# Altium project eRTM15_Baikal.PrjPCB (part 4 of 4)
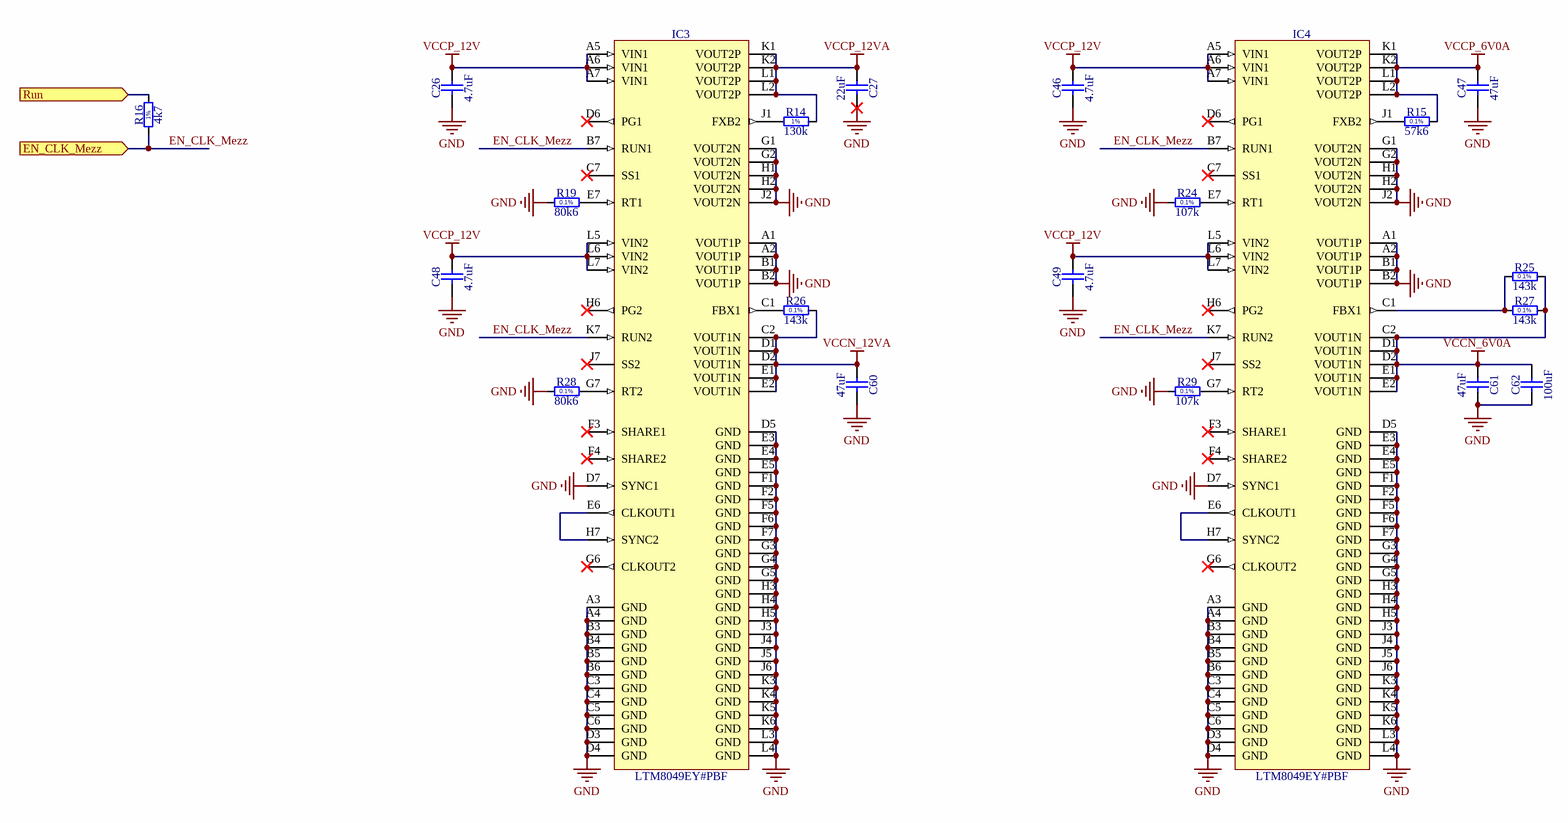
[diagram p111: PowerSupply4ClkMezzanine.SchDoc]

## Nets that join several sheets
GND: FP_connectors (30 pins), PowerSupply (79 pins), BackPlane_connectors (68 pins), CLK_Mezzanine (20 pins), Reference_distribution (37 pins), U_Reference_distribution/U_Diff2SE (5 pins), U_Reference_distribution/U_Diff2SE (5 pins), U_Reference_distribution/U_Diff2SE (5 pins), U_Reference_distribution/U_Diff2SE (5 pins), U_Reference_distribution/U_Diff2SE (5 pins), U_Reference_distribution/U_Diff2SE (5 pins), U_Reference_distribution/U_Diff2SE (5 pins), U_Reference_distribution/U_Diff2SE (5 pins), U_Reference_distribution/U_Diff2SE (5 pins), U_Reference_distribution/U_Diff2SE (5 pins), U_Reference_distribution/U_Diff2SE (5 pins), U_Reference_distribution/U_Diff2SE (5 pins), U_Reference_distribution/U_LvpeclTermWithCtrl (C59_1.1 R23_1.1 T1_1.2), U_Reference_distribution/U_LvpeclTermWithCtrl (C59_2.1 R23_2.1 T1_2.2), U_Reference_distribution/U_LvpeclTermWithCtrl (C59_3.1 R23_3.1 T1_3.2), U_Reference_distribution/U_LvpeclTermWithCtrl (C59_4.1 R23_4.1 T1_4.2), U_Reference_distribution/U_LvpeclTermWithCtrl (C59_5.1 R23_5.1 T1_5.2), U_Reference_distribution/U_LvpeclTermWithCtrl (C59_6.1 R23_6.1 T1_6.2), U_Reference_distribution/U_LvpeclTermWithCtrl (C59_7.1 R23_7.1 T1_7.2), U_Reference_distribution/U_LvpeclTermWithCtrl (C59_8.1 R23_8.1 T1_8.2), U_Reference_distribution/U_LvpeclTermWithCtrl (C59_9.1 R23_9.1 T1_9.2), U_Reference_distribution/U_LvpeclTermWithCtrl (C59_10.1 R23_10.1 T1_10.2), U_Reference_distribution/U_Diff2SE (5 pins), U_Reference_distribution/U_LvpeclTermWithCtrl (C59_11.1 R23_11.1 T1_11.2), U_Reference_distribution/U_LvpeclTermWithCtrl (C59_12.1 R23_12.1 T1_12.2), U_Reference_distribution/U_LvpeclTermWithCtrl (C59_13.1 R23_13.1 T1_13.2), U_Reference_distribution/U_LvpeclTermWithCtrl (C59_14.1 R23_14.1 T1_14.2), U_Reference_distribution/U_LvpeclTermWithCtrl (C59_15.1 R23_15.1 T1_15.2), U_Reference_distribution/U_LvpeclTermWithCtrl (C59_16.1 R23_16.1 T1_16.2), U_Reference_distribution/U_LvpeclTermWithCtrl (C59_17.1 R23_17.1 T1_17.2), U_Reference_distribution/U_LvpeclTermWithCtrl (C59_18.1 R23_18.1 T1_18.2), U_Reference_distribution/U_LvpeclTermWithCtrl (C59_19.1 R23_19.1 T1_19.2), U_Reference_distribution/U_LvpeclTermWithCtrl (C59_20.1 R23_20.1 T1_20.2), U_Reference_distribution/U_LvpeclTermWithCtrl (C59_21.1 R23_21.1 T1_21.2), U_Reference_distribution/U_LvpeclTermWithCtrl (C59_22.1 R23_22.1 T1_22.2), U_Reference_distribution/U_LvpeclTermWithCtrl (C59_23.1 R23_23.1 T1_23.2), OnBoardOsc (8 pins), U_LO_distribution (12 pins), U_LO_distribution/U_Diff2SE (5 pins), U_LO_distribution/U_Diff2SE (5 pins), U_LO_distribution/U_Diff2SE (5 pins), U_LO_distribution/U_Diff2SE (5 pins), U_LO_distribution/U_Diff2SE (5 pins), U_LO_distribution/U_Diff2SE (5 pins), U_LO_distribution/U_Diff2SE (5 pins), U_LO_distribution/U_Diff2SE (5 pins), U_LO_distribution/U_Diff2SE (5 pins), U_LO_distribution/U_Diff2SE (5 pins), U_LO_distribution/U_LvpeclTermWithCtrl (C59_24.1 R23_24.1 T1_24.2), U_LO_distribution/U_LvpeclTermWithCtrl (C59_25.1 R23_25.1 T1_25.2), U_LO_distribution/U_LvpeclTermWithCtrl (C59_26.1 R23_26.1 T1_26.2), U_LO_distribution/U_LvpeclTermWithCtrl (C59_27.1 R23_27.1 T1_27.2), U_LO_distribution/U_LvpeclTermWithCtrl (C59_28.1 R23_28.1 T1_28.2), U_LO_distribution/U_LvpeclTermWithCtrl (C59_29.1 R23_29.1 T1_29.2), U_LO_distribution/U_LvpeclTermWithCtrl (C59_30.1 R23_30.1 T1_30.2), U_LO_distribution/U_LvpeclTermWithCtrl (C59_31.1 R23_31.1 T1_31.2), U_LO_distribution/U_LvpeclTermWithCtrl (C59_32.1 R23_32.1 T1_32.2), U_LO_distribution/U_Diff2SE (5 pins), U_LO_distribution/U_LvpeclTermWithCtrl (C59_33.1 R23_33.1 T1_33.2), U_HF_CLK_Distribution (12 pins), U_HF_CLK_Distribution/U_Diff2SE (5 pins), U_HF_CLK_Distribution/U_Diff2SE (5 pins), U_HF_CLK_Distribution/U_Diff2SE (5 pins), U_HF_CLK_Distribution/U_Diff2SE (5 pins), U_HF_CLK_Distribution/U_Diff2SE (5 pins), U_HF_CLK_Distribution/U_Diff2SE (5 pins), U_HF_CLK_Distribution/U_Diff2SE (5 pins), U_HF_CLK_Distribution/U_Diff2SE (5 pins), U_HF_CLK_Distribution/U_Diff2SE (5 pins), U_HF_CLK_Distribution/U_Diff2SE (5 pins), U_HF_CLK_Distribution/U_LvpeclTermWithCtrl (C59_34.1 R23_34.1 T1_34.2), U_HF_CLK_Distribution/U_LvpeclTermWithCtrl (C59_35.1 R23_35.1 T1_35.2), U_HF_CLK_Distribution/U_LvpeclTermWithCtrl (C59_36.1 R23_36.1 T1_36.2), U_HF_CLK_Distribution/U_LvpeclTermWithCtrl (C59_37.1 R23_37.1 T1_37.2), U_HF_CLK_Distribution/U_LvpeclTermWithCtrl (C59_38.1 R23_38.1 T1_38.2), U_HF_CLK_Distribution/U_LvpeclTermWithCtrl (C59_39.1 R23_39.1 T1_39.2), U_HF_CLK_Distribution/U_LvpeclTermWithCtrl (C59_40.1 R23_40.1 T1_40.2), U_HF_CLK_Distribution/U_LvpeclTermWithCtrl (C59_41.1 R23_41.1 T1_41.2), U_HF_CLK_Distribution/U_LvpeclTermWithCtrl (C59_42.1 R23_42.1 T1_42.2), U_HF_CLK_Distribution/U_Diff2SE (5 pins), U_HF_CLK_Distribution/U_LvpeclTermWithCtrl (C59_43.1 R23_43.1 T1_43.2), CTRL (SW1.1 SW1.2 SW1.3 SW1.4), PowerSupply4ClkMezzanine (107 pins)
VCCN_6V0A: CLK_Mezzanine (J2.32), PowerSupply4ClkMezzanine (9 pins)
VCCN_12VA: CLK_Mezzanine (J2.26), PowerSupply4ClkMezzanine (7 pins)
VCCP_3V3: PowerSupply (C74.2 IC9.9 IC9.10), CLK_Mezzanine (L5.2), Reference_distribution (L2.1 L3.2 L4.1 L11.2), OnBoardOsc (L1.2), U_LO_distribution (L8_1.2), U_HF_CLK_Distribution (L8_2.2)
VCCP_6V0A: CLK_Mezzanine (J2.31 J2.33), PowerSupply4ClkMezzanine (6 pins)
VCCP_12V: PowerSupply (9 pins), BackPlane_connectors (J30.9a J30.9b J30.10a J30.10b), PowerSupply4ClkMezzanine (16 pins)
VCCP_12VA: CLK_Mezzanine (J2.25), PowerSupply4ClkMezzanine (6 pins)
CLKs.4A_N: Reference_distribution (U1.39), U_Reference_distribution/U_LvpeclTermWithCtrl (R22_13.1)
CLKs.4A_P: Reference_distribution (U1.38), U_Reference_distribution/U_LvpeclTermWithCtrl (R21_13.1)
CLKs.5A_N: Reference_distribution (U1.36), U_Reference_distribution/U_LvpeclTermWithCtrl (R22_19.1)
CLKs.5A_P: Reference_distribution (U1.37), U_Reference_distribution/U_LvpeclTermWithCtrl (R21_19.1)
CLKs.6A_N: Reference_distribution (U1.34), U_Reference_distribution/U_LvpeclTermWithCtrl (R22_14.1)
CLKs.6A_P: Reference_distribution (U1.35), U_Reference_distribution/U_LvpeclTermWithCtrl (R21_14.1)
CLKs.7A_N: Reference_distribution (U1.33), U_Reference_distribution/U_LvpeclTermWithCtrl (R21_20.1)
CLKs.7A_P: Reference_distribution (U1.32), U_Reference_distribution/U_LvpeclTermWithCtrl (R22_20.1)
CLKs.8A_N: Reference_distribution (U1.29), U_Reference_distribution/U_LvpeclTermWithCtrl (R22_15.1)
CLKs.8A_P: Reference_distribution (U1.28), U_Reference_distribution/U_LvpeclTermWithCtrl (R21_15.1)
CLKs.9A_N: Reference_distribution (U1.26), U_Reference_distribution/U_LvpeclTermWithCtrl (R22_21.1)
CLKs.9A_P: Reference_distribution (U1.27), U_Reference_distribution/U_LvpeclTermWithCtrl (R21_21.1)
CLKs.10A_N: Reference_distribution (U1.24), U_Reference_distribution/U_LvpeclTermWithCtrl (R22_16.1)
CLKs.10A_P: Reference_distribution (U1.25), U_Reference_distribution/U_LvpeclTermWithCtrl (R21_16.1)
CLKs.11A_N: Reference_distribution (U1.22), U_Reference_distribution/U_LvpeclTermWithCtrl (R22_22.1)
CLKs.11A_P: Reference_distribution (U1.23), U_Reference_distribution/U_LvpeclTermWithCtrl (R21_22.1)
CLKs.12A_N: Reference_distribution (U1.18), U_Reference_distribution/U_LvpeclTermWithCtrl (R22_17.1)
CLKs.12A_P: Reference_distribution (U1.19), U_Reference_distribution/U_LvpeclTermWithCtrl (R21_17.1)
CLKs.13A_N: Reference_distribution (U1.16), U_Reference_distribution/U_LvpeclTermWithCtrl (R22_23.1)
CLKs.13A_P: Reference_distribution (U1.17), U_Reference_distribution/U_LvpeclTermWithCtrl (R21_23.1)
CLKs.14A_N: Reference_distribution (U1.15), U_Reference_distribution/U_LvpeclTermWithCtrl (R21_18.1)
CLKs.14A_P: Reference_distribution (U1.14), U_Reference_distribution/U_LvpeclTermWithCtrl (R22_18.1)
Diff_N: Reference_distribution (IC1.4 R3.1), U_Reference_distribution/U_Diff2SE (C12_11.1)
Diff_N: U_LO_distribution (U3_1.2), U_LO_distribution/U_Diff2SE (C12_23.1)
Diff_N: U_HF_CLK_Distribution (U3_2.2), U_HF_CLK_Distribution/U_Diff2SE (C12_34.1)
Diff_P: Reference_distribution (IC1.3 R3.2), U_Reference_distribution/U_Diff2SE (C7_11.1)
Diff_P: U_LO_distribution (U3_1.3), U_LO_distribution/U_Diff2SE (C7_23.1)
Diff_P: U_HF_CLK_Distribution (U3_2.3), U_HF_CLK_Distribution/U_Diff2SE (C7_34.1)
EN4: BackPlane_connectors (J31.2d), U_Reference_distribution/U_LvpeclTermWithCtrl (R23_1.2 T1_1.1), U_LO_distribution/U_LvpeclTermWithCtrl (R23_24.2 T1_24.1), U_HF_CLK_Distribution/U_LvpeclTermWithCtrl (R23_34.2 T1_34.1)
EN5: BackPlane_connectors (J31.2e), U_Reference_distribution/U_LvpeclTermWithCtrl (R23_6.2 T1_6.1), U_LO_distribution/U_LvpeclTermWithCtrl (R23_29.2 T1_29.1), U_HF_CLK_Distribution/U_LvpeclTermWithCtrl (R23_39.2 T1_39.1)
EN6: BackPlane_connectors (J31.2f), U_Reference_distribution/U_LvpeclTermWithCtrl (R23_2.2 T1_2.1), U_LO_distribution/U_LvpeclTermWithCtrl (R23_25.2 T1_25.1), U_HF_CLK_Distribution/U_LvpeclTermWithCtrl (R23_35.2 T1_35.1)
EN7: BackPlane_connectors (J31.3a), U_Reference_distribution/U_LvpeclTermWithCtrl (R23_7.2 T1_7.1), U_LO_distribution/U_LvpeclTermWithCtrl (R23_30.2 T1_30.1), U_HF_CLK_Distribution/U_LvpeclTermWithCtrl (R23_40.2 T1_40.1)
EN8: BackPlane_connectors (J31.3b), U_Reference_distribution/U_LvpeclTermWithCtrl (R23_3.2 T1_3.1), U_LO_distribution/U_LvpeclTermWithCtrl (R23_26.2 T1_26.1), U_HF_CLK_Distribution/U_LvpeclTermWithCtrl (R23_36.2 T1_36.1)
EN9: BackPlane_connectors (J31.3c), U_Reference_distribution/U_LvpeclTermWithCtrl (R23_8.2 T1_8.1), U_LO_distribution/U_LvpeclTermWithCtrl (R23_31.2 T1_31.1), U_HF_CLK_Distribution/U_LvpeclTermWithCtrl (R23_41.2 T1_41.1)
EN10: BackPlane_connectors (J31.3d), U_Reference_distribution/U_LvpeclTermWithCtrl (R23_4.2 T1_4.1), U_LO_distribution/U_LvpeclTermWithCtrl (R23_27.2 T1_27.1), U_HF_CLK_Distribution/U_LvpeclTermWithCtrl (R23_37.2 T1_37.1)
EN11: BackPlane_connectors (J31.3e), U_Reference_distribution/U_LvpeclTermWithCtrl (R23_9.2 T1_9.1), U_LO_distribution/U_LvpeclTermWithCtrl (R23_32.2 T1_32.1), U_HF_CLK_Distribution/U_LvpeclTermWithCtrl (R23_42.2 T1_42.1)
EN12: BackPlane_connectors (J31.3f), U_Reference_distribution/U_LvpeclTermWithCtrl (R23_5.2 T1_5.1), U_LO_distribution/U_LvpeclTermWithCtrl (R23_28.2 T1_28.1), U_HF_CLK_Distribution/U_LvpeclTermWithCtrl (R23_38.2 T1_38.1)
EN_CLK_Mezz: CTRL (SW1.5), PowerSupply4ClkMezzanine (5 pins)
HF_CLK4: BackPlane_connectors (J3_15.A/1C), U_HF_CLK_Distribution/U_Diff2SE (C17_25.2)
HF_CLK5: BackPlane_connectors (J3_15.B/1C), U_HF_CLK_Distribution/U_Diff2SE (C17_26.2)
HF_CLK6: BackPlane_connectors (J3_15.A/1B), U_HF_CLK_Distribution/U_Diff2SE (C17_27.2)
HF_CLK7: BackPlane_connectors (J3_15.B/1B), U_HF_CLK_Distribution/U_Diff2SE (C17_28.2)
HF_CLK8: BackPlane_connectors (J3_15.A/1A), U_HF_CLK_Distribution/U_Diff2SE (C17_29.2)
HF_CLK9: BackPlane_connectors (J3_15.B/1A), U_HF_CLK_Distribution/U_Diff2SE (C17_30.2)
HF_CLK10: BackPlane_connectors (J2_15.B/1C), U_HF_CLK_Distribution/U_Diff2SE (C17_31.2)
HF_CLK11: BackPlane_connectors (J2_15.A/1C), U_HF_CLK_Distribution/U_Diff2SE (C17_32.2)
HF_CLK12: BackPlane_connectors (J2_15.A/1B), U_HF_CLK_Distribution/U_Diff2SE (C17_33.2)
HF_CLK_IN: FP_connectors (J4.1), U_HF_CLK_Distribution/U_Diff2SE (C17_34.2)
HF_CLK_OUT: FP_connectors (J5.1), U_HF_CLK_Distribution/U_Diff2SE (C17_35.2)
HF_CLK_OUT_N: CLK_Mezzanine (J12.1), U_HF_CLK_Distribution (C11_2.1)
HF_CLK_OUT_P: CLK_Mezzanine (J10.1), U_HF_CLK_Distribution (C25_2.1)
IN_SEL: Reference_distribution (R11.2 R40.2 U1.1 U2.1), CTRL (SW1.8)
IN_SEL: U_LO_distribution (R20_1.2 U3_1.1), CTRL (SW1.7)
IN_SEL: U_HF_CLK_Distribution (R20_2.2 U3_2.1), CTRL (SW1.6)
LO4: BackPlane_connectors (J2_15.B/1B), U_LO_distribution/U_Diff2SE (C17_14.2)
LO5: BackPlane_connectors (J2_15.A/1A), U_LO_distribution/U_Diff2SE (C17_15.2)
LO6: BackPlane_connectors (J2_15.B/1A), U_LO_distribution/U_Diff2SE (C17_16.2)
LO7: BackPlane_connectors (J1_15.B/1C), U_LO_distribution/U_Diff2SE (C17_17.2)
LO8: BackPlane_connectors (J1_15.A/1C), U_LO_distribution/U_Diff2SE (C17_18.2)
LO9: BackPlane_connectors (J1_15.B/1B), U_LO_distribution/U_Diff2SE (C17_19.2)
LO10: BackPlane_connectors (J1_15.A/1B), U_LO_distribution/U_Diff2SE (C17_20.2)
LO11: BackPlane_connectors (J1_15.B/1A), U_LO_distribution/U_Diff2SE (C17_21.2)
LO12: BackPlane_connectors (J1_15.A/1A), U_LO_distribution/U_Diff2SE (C17_22.2)
LO_IN: FP_connectors (J18.1), U_LO_distribution/U_Diff2SE (C17_23.2)
LO_OUT: FP_connectors (J6.1), U_LO_distribution/U_Diff2SE (C17_24.2)
Osc_out: U_Reference_distribution/U_Diff2SE (C17_12.2), OnBoardOsc (OSC1.3)
Q2_0_N: Reference_distribution (U2.38), U_Reference_distribution/U_Diff2SE (C12_1.1), U_Reference_distribution/U_LvpeclTermWithCtrl (R22_1.1)
Q2_0_N_U_HF_CLK_Distribution: U_HF_CLK_Distribution (U3_2.38), U_HF_CLK_Distribution/U_Diff2SE (C12_25.1), U_HF_CLK_Distribution/U_LvpeclTermWithCtrl (R22_34.1)
Q2_0_N_U_LO_distribution: U_LO_distribution (U3_1.38), U_LO_distribution/U_Diff2SE (C12_14.1), U_LO_distribution/U_LvpeclTermWithCtrl (R22_24.1)
Q2_0_P: Reference_distribution (U2.39), U_Reference_distribution/U_Diff2SE (C7_1.1), U_Reference_distribution/U_LvpeclTermWithCtrl (R21_1.1)
Q2_0_P_U_HF_CLK_Distribution: U_HF_CLK_Distribution (U3_2.39), U_HF_CLK_Distribution/U_Diff2SE (C7_25.1), U_HF_CLK_Distribution/U_LvpeclTermWithCtrl (R21_34.1)
Q2_0_P_U_LO_distribution: U_LO_distribution (U3_1.39), U_LO_distribution/U_Diff2SE (C7_14.1), U_LO_distribution/U_LvpeclTermWithCtrl (R21_24.1)
Q2_1_N: Reference_distribution (U2.36), U_Reference_distribution/U_Diff2SE (C12_2.1), U_Reference_distribution/U_LvpeclTermWithCtrl (R22_6.1)
Q2_1_N_U_HF_CLK_Distribution: U_HF_CLK_Distribution (U3_2.36), U_HF_CLK_Distribution/U_Diff2SE (C12_26.1), U_HF_CLK_Distribution/U_LvpeclTermWithCtrl (R22_39.1)
Q2_1_N_U_LO_distribution: U_LO_distribution (U3_1.36), U_LO_distribution/U_Diff2SE (C12_15.1), U_LO_distribution/U_LvpeclTermWithCtrl (R22_29.1)
Q2_1_P: Reference_distribution (U2.37), U_Reference_distribution/U_Diff2SE (C7_2.1), U_Reference_distribution/U_LvpeclTermWithCtrl (R21_6.1)
Q2_1_P_U_HF_CLK_Distribution: U_HF_CLK_Distribution (U3_2.37), U_HF_CLK_Distribution/U_Diff2SE (C7_26.1), U_HF_CLK_Distribution/U_LvpeclTermWithCtrl (R21_39.1)
Q2_1_P_U_LO_distribution: U_LO_distribution (U3_1.37), U_LO_distribution/U_Diff2SE (C7_15.1), U_LO_distribution/U_LvpeclTermWithCtrl (R21_29.1)
Q2_2_N: Reference_distribution (U2.34), U_Reference_distribution/U_Diff2SE (C12_3.1), U_Reference_distribution/U_LvpeclTermWithCtrl (R22_2.1)
Q2_2_N_U_HF_CLK_Distribution: U_HF_CLK_Distribution (U3_2.34), U_HF_CLK_Distribution/U_Diff2SE (C12_27.1), U_HF_CLK_Distribution/U_LvpeclTermWithCtrl (R22_35.1)
Q2_2_N_U_LO_distribution: U_LO_distribution (U3_1.34), U_LO_distribution/U_Diff2SE (C12_16.1), U_LO_distribution/U_LvpeclTermWithCtrl (R22_25.1)
Q2_2_P: Reference_distribution (U2.35), U_Reference_distribution/U_Diff2SE (C7_3.1), U_Reference_distribution/U_LvpeclTermWithCtrl (R21_2.1)
Q2_2_P_U_HF_CLK_Distribution: U_HF_CLK_Distribution (U3_2.35), U_HF_CLK_Distribution/U_Diff2SE (C7_27.1), U_HF_CLK_Distribution/U_LvpeclTermWithCtrl (R21_35.1)
Q2_2_P_U_LO_distribution: U_LO_distribution (U3_1.35), U_LO_distribution/U_Diff2SE (C7_16.1), U_LO_distribution/U_LvpeclTermWithCtrl (R21_25.1)
Q2_3_N: Reference_distribution (U2.32), U_Reference_distribution/U_Diff2SE (C12_4.1), U_Reference_distribution/U_LvpeclTermWithCtrl (R22_7.1)
Q2_3_N_U_HF_CLK_Distribution: U_HF_CLK_Distribution (U3_2.32), U_HF_CLK_Distribution/U_Diff2SE (C12_28.1), U_HF_CLK_Distribution/U_LvpeclTermWithCtrl (R22_40.1)
Q2_3_N_U_LO_distribution: U_LO_distribution (U3_1.32), U_LO_distribution/U_Diff2SE (C12_17.1), U_LO_distribution/U_LvpeclTermWithCtrl (R22_30.1)
Q2_3_P: Reference_distribution (U2.33), U_Reference_distribution/U_Diff2SE (C7_4.1), U_Reference_distribution/U_LvpeclTermWithCtrl (R21_7.1)
Q2_3_P_U_HF_CLK_Distribution: U_HF_CLK_Distribution (U3_2.33), U_HF_CLK_Distribution/U_Diff2SE (C7_28.1), U_HF_CLK_Distribution/U_LvpeclTermWithCtrl (R21_40.1)
Q2_3_P_U_LO_distribution: U_LO_distribution (U3_1.33), U_LO_distribution/U_Diff2SE (C7_17.1), U_LO_distribution/U_LvpeclTermWithCtrl (R21_30.1)
Q2_4_N: Reference_distribution (U2.28), U_Reference_distribution/U_Diff2SE (C12_5.1), U_Reference_distribution/U_LvpeclTermWithCtrl (R22_3.1)
Q2_4_N_U_HF_CLK_Distribution: U_HF_CLK_Distribution (U3_2.28), U_HF_CLK_Distribution/U_Diff2SE (C7_29.1), U_HF_CLK_Distribution/U_LvpeclTermWithCtrl (R22_36.1)
Q2_4_N_U_LO_distribution: U_LO_distribution (U3_1.28), U_LO_distribution/U_Diff2SE (C7_18.1), U_LO_distribution/U_LvpeclTermWithCtrl (R22_26.1)
Q2_4_P: Reference_distribution (U2.29), U_Reference_distribution/U_Diff2SE (C7_5.1), U_Reference_distribution/U_LvpeclTermWithCtrl (R21_3.1)
Q2_4_P_U_HF_CLK_Distribution: U_HF_CLK_Distribution (U3_2.29), U_HF_CLK_Distribution/U_Diff2SE (C12_29.1), U_HF_CLK_Distribution/U_LvpeclTermWithCtrl (R21_36.1)
Q2_4_P_U_LO_distribution: U_LO_distribution (U3_1.29), U_LO_distribution/U_Diff2SE (C12_18.1), U_LO_distribution/U_LvpeclTermWithCtrl (R21_26.1)
Q2_5_N: Reference_distribution (U2.26), U_Reference_distribution/U_Diff2SE (C12_6.1), U_Reference_distribution/U_LvpeclTermWithCtrl (R22_8.1)
Q2_5_N_U_HF_CLK_Distribution: U_HF_CLK_Distribution (U3_2.26), U_HF_CLK_Distribution/U_Diff2SE (C12_30.1), U_HF_CLK_Distribution/U_LvpeclTermWithCtrl (R22_41.1)
Q2_5_N_U_LO_distribution: U_LO_distribution (U3_1.26), U_LO_distribution/U_Diff2SE (C12_19.1), U_LO_distribution/U_LvpeclTermWithCtrl (R22_31.1)
Q2_5_P: Reference_distribution (U2.27), U_Reference_distribution/U_Diff2SE (C7_6.1), U_Reference_distribution/U_LvpeclTermWithCtrl (R21_8.1)
Q2_5_P_U_HF_CLK_Distribution: U_HF_CLK_Distribution (U3_2.27), U_HF_CLK_Distribution/U_Diff2SE (C7_30.1), U_HF_CLK_Distribution/U_LvpeclTermWithCtrl (R21_41.1)
Q2_5_P_U_LO_distribution: U_LO_distribution (U3_1.27), U_LO_distribution/U_Diff2SE (C7_19.1), U_LO_distribution/U_LvpeclTermWithCtrl (R21_31.1)
Q2_6_N: Reference_distribution (U2.24), U_Reference_distribution/U_Diff2SE (C7_7.1), U_Reference_distribution/U_LvpeclTermWithCtrl (R22_4.1)
Q2_6_N_U_HF_CLK_Distribution: U_HF_CLK_Distribution (U3_2.24), U_HF_CLK_Distribution/U_Diff2SE (C7_31.1), U_HF_CLK_Distribution/U_LvpeclTermWithCtrl (R22_37.1)
Q2_6_N_U_LO_distribution: U_LO_distribution (U3_1.24), U_LO_distribution/U_Diff2SE (C7_20.1), U_LO_distribution/U_LvpeclTermWithCtrl (R22_27.1)
Q2_6_P: Reference_distribution (U2.25), U_Reference_distribution/U_Diff2SE (C12_7.1), U_Reference_distribution/U_LvpeclTermWithCtrl (R21_4.1)
Q2_6_P_U_HF_CLK_Distribution: U_HF_CLK_Distribution (U3_2.25), U_HF_CLK_Distribution/U_Diff2SE (C12_31.1), U_HF_CLK_Distribution/U_LvpeclTermWithCtrl (R21_37.1)
Q2_6_P_U_LO_distribution: U_LO_distribution (U3_1.25), U_LO_distribution/U_Diff2SE (C12_20.1), U_LO_distribution/U_LvpeclTermWithCtrl (R21_27.1)
Q2_7_N: Reference_distribution (U2.22), U_Reference_distribution/U_Diff2SE (C12_8.1), U_Reference_distribution/U_LvpeclTermWithCtrl (R22_9.1)
Q2_7_N_U_HF_CLK_Distribution: U_HF_CLK_Distribution (U3_2.22), U_HF_CLK_Distribution/U_Diff2SE (C12_32.1), U_HF_CLK_Distribution/U_LvpeclTermWithCtrl (R22_42.1)
Q2_7_N_U_LO_distribution: U_LO_distribution (U3_1.22), U_LO_distribution/U_Diff2SE (C12_21.1), U_LO_distribution/U_LvpeclTermWithCtrl (R22_32.1)
Q2_7_P: Reference_distribution (U2.23), U_Reference_distribution/U_Diff2SE (C7_8.1), U_Reference_distribution/U_LvpeclTermWithCtrl (R21_9.1)
Q2_7_P_U_HF_CLK_Distribution: U_HF_CLK_Distribution (U3_2.23), U_HF_CLK_Distribution/U_Diff2SE (C7_32.1), U_HF_CLK_Distribution/U_LvpeclTermWithCtrl (R21_42.1)
Q2_7_P_U_LO_distribution: U_LO_distribution (U3_1.23), U_LO_distribution/U_Diff2SE (C7_21.1), U_LO_distribution/U_LvpeclTermWithCtrl (R21_32.1)
Q2_8_N: Reference_distribution (U2.18), U_Reference_distribution/U_Diff2SE (C7_9.1), U_Reference_distribution/U_LvpeclTermWithCtrl (R22_5.1)
Q2_8_N_U_HF_CLK_Distribution: U_HF_CLK_Distribution (U3_2.18), U_HF_CLK_Distribution/U_Diff2SE (C12_33.1), U_HF_CLK_Distribution/U_LvpeclTermWithCtrl (R22_38.1)
Q2_8_N_U_LO_distribution: U_LO_distribution (U3_1.18), U_LO_distribution/U_Diff2SE (C12_22.1), U_LO_distribution/U_LvpeclTermWithCtrl (R22_28.1)
Q2_8_P: Reference_distribution (U2.19), U_Reference_distribution/U_Diff2SE (C12_9.1), U_Reference_distribution/U_LvpeclTermWithCtrl (R21_5.1)
Q2_8_P_U_HF_CLK_Distribution: U_HF_CLK_Distribution (U3_2.19), U_HF_CLK_Distribution/U_Diff2SE (C7_33.1), U_HF_CLK_Distribution/U_LvpeclTermWithCtrl (R21_38.1)
Q2_8_P_U_LO_distribution: U_LO_distribution (U3_1.19), U_LO_distribution/U_Diff2SE (C7_22.1), U_LO_distribution/U_LvpeclTermWithCtrl (R21_28.1)
Q2_9_N: Reference_distribution (U2.16), U_Reference_distribution/U_Diff2SE (C12_10.1), U_Reference_distribution/U_LvpeclTermWithCtrl (R22_10.1)
Q2_9_P: Reference_distribution (U2.17), U_Reference_distribution/U_Diff2SE (C7_10.1), U_Reference_distribution/U_LvpeclTermWithCtrl (R21_10.1)
Q2_10_N: Reference_distribution (C38.1 U2.14), U_Reference_distribution/U_LvpeclTermWithCtrl (R22_12.1)
Q2_10_P: Reference_distribution (C36.1 U2.15), U_Reference_distribution/U_LvpeclTermWithCtrl (R21_12.1)
Q2_11_N: Reference_distribution (U2.12), U_Reference_distribution/U_Diff2SE (C12_13.1), U_Reference_distribution/U_LvpeclTermWithCtrl (R22_11.1)
Q2_11_N_U_HF_CLK_Distribution: U_HF_CLK_Distribution (U3_2.13), U_HF_CLK_Distribution/U_Diff2SE (C12_35.1), U_HF_CLK_Distribution/U_LvpeclTermWithCtrl (R22_43.1)
Q2_11_N_U_LO_distribution: U_LO_distribution (U3_1.13), U_LO_distribution/U_Diff2SE (C12_24.1), U_LO_distribution/U_LvpeclTermWithCtrl (R22_33.1)
Q2_11_P: Reference_distribution (U2.13), U_Reference_distribution/U_Diff2SE (C7_13.1), U_Reference_distribution/U_LvpeclTermWithCtrl (R21_11.1)
Q2_11_P_U_HF_CLK_Distribution: U_HF_CLK_Distribution (U3_2.12), U_HF_CLK_Distribution/U_Diff2SE (C7_35.1), U_HF_CLK_Distribution/U_LvpeclTermWithCtrl (R21_43.1)
Q2_11_P_U_LO_distribution: U_LO_distribution (U3_1.12), U_LO_distribution/U_Diff2SE (C7_24.1), U_LO_distribution/U_LvpeclTermWithCtrl (R21_33.1)
REF4: BackPlane_connectors (J4_15.A/1C), U_Reference_distribution/U_Diff2SE (C17_1.2)
REF5: BackPlane_connectors (J5_15.A/1B), U_Reference_distribution/U_Diff2SE (C17_2.2)
REF6: BackPlane_connectors (J5_15.A/1A), U_Reference_distribution/U_Diff2SE (C17_3.2)
REF7: BackPlane_connectors (J5_15.B/1A), U_Reference_distribution/U_Diff2SE (C17_4.2)
REF8: BackPlane_connectors (J4_15.B/1C), U_Reference_distribution/U_Diff2SE (C17_5.2)
REF9: BackPlane_connectors (J4_15.A/1B), U_Reference_distribution/U_Diff2SE (C17_6.2)
REF10: BackPlane_connectors (J4_15.B/1A), U_Reference_distribution/U_Diff2SE (C17_7.2)
REF11: BackPlane_connectors (J4_15.A/1A), U_Reference_distribution/U_Diff2SE (C17_8.2)
REF12: BackPlane_connectors (J4_15.B/1B), U_Reference_distribution/U_Diff2SE (C17_9.2)
REF_CLK_IN_N: CLK_Mezzanine (J15.1), Reference_distribution (C38.2)
REF_CLK_IN_P: CLK_Mezzanine (J13.1), Reference_distribution (C36.2)
REF_IN: FP_connectors (J1.1), U_Reference_distribution/U_Diff2SE (C17_11.2)
REF_LO_OUT_N: CLK_Mezzanine (J16.1), U_LO_distribution (C11_1.1)
REF_LO_OUT_P: CLK_Mezzanine (J14.1), U_LO_distribution (C25_1.1)
REF_OUT: FP_connectors (J3.1), U_Reference_distribution/U_Diff2SE (C17_13.2)
RUN: PowerSupply (IC6.L5 R1.2 S1.A S1.C), PowerSupply4ClkMezzanine (R16.2)
SIG2_N: Reference_distribution (IC2.3 R10.1), U_Reference_distribution/U_Diff2SE (C12_12.1)
SIG2_P: Reference_distribution (IC2.4 R10.2), U_Reference_distribution/U_Diff2SE (C7_12.1)
SingleEnded: Reference_distribution (J8.1), U_Reference_distribution/U_Diff2SE (C17_10.2)